# EAGLE design satshakit128 (EAGLE 7.5.0)
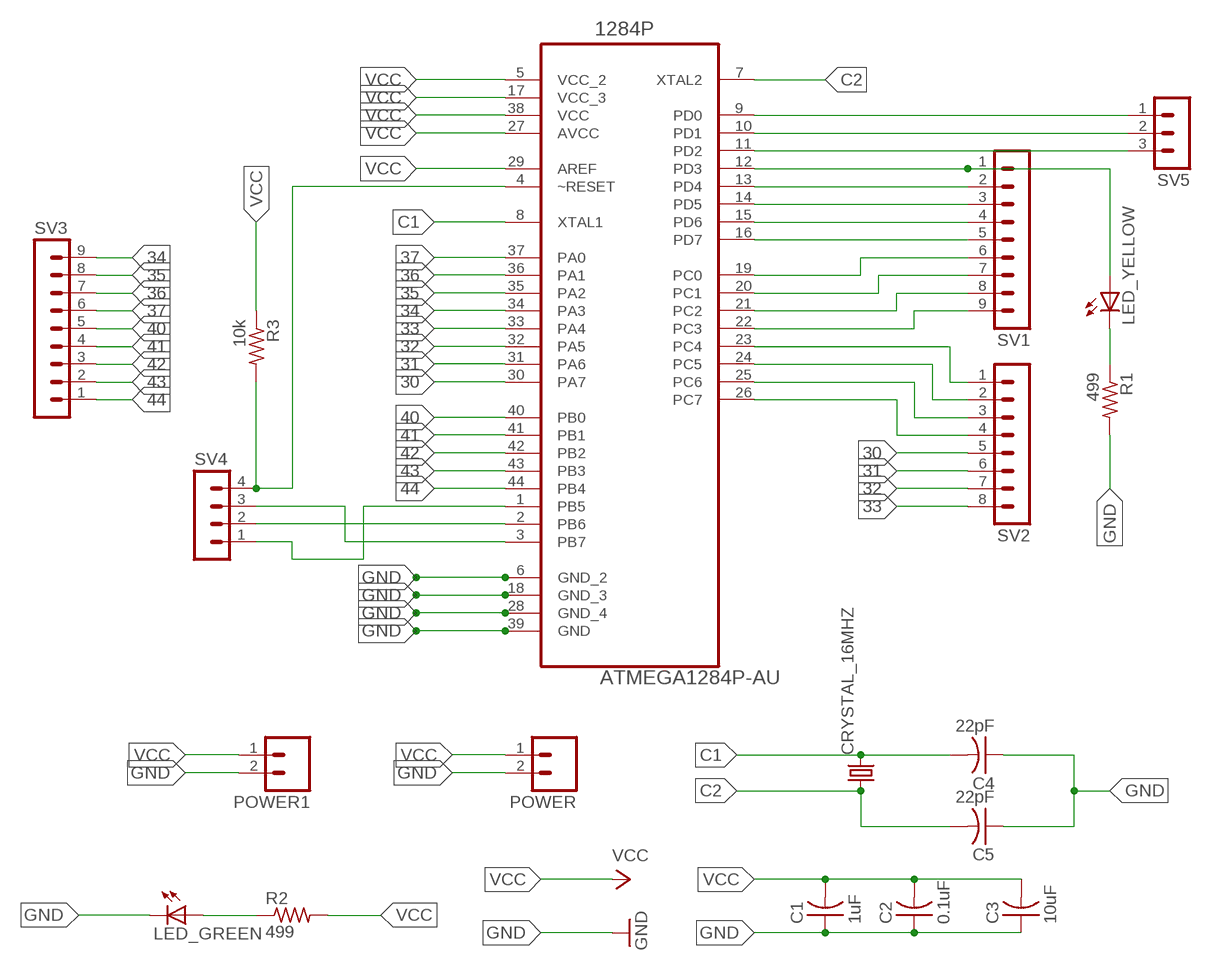
[diagram p0: schematic, sheet 1]

## Parts
1284P  ATMEGA1284P-AU  [QFP80P1200X1200X120-44N]
C1  1uF  CAP-US1206  [C1206]
C2  0.1uF  CAP-US1206  [C1206]
C3  10uF  CAP-US1206  [C1206]
C4  22pF  CAP-US1206  [C1206]
C5  22pF  CAP-US1206  [C1206]
CRYSTAL_16MHZ  CRYSTALHC49UP  [HC49UP]
LED_GREEN  LED1206  [1206]
LED_YELLOW  LED1206  [1206]
POWER  M02  [02P]
POWER1  M02  [02P]
R1  499  RES-US1206  [R1206]
R2  499  RES-US1206  [R1206]
R3  10k  RES-US1206  [R1206]
SV1  MA09-1  [MA09-1]
SV2  MA08-1  [MA08-1]
SV3  MA09-1  [MA09-1]
SV4  MA04-1  [MA04-1]
SV5  MA03-1  [MA03-1]

## Nets
30: 1284P.30(PA7) SV2.5
31: 1284P.31(PA6) SV2.6
32: 1284P.32(PA5) SV2.7
33: 1284P.33(PA4) SV2.8
34: 1284P.34(PA3) SV3.9
35: 1284P.35(PA2) SV3.8
36: 1284P.36(PA1) SV3.7
37: 1284P.37(PA0) SV3.6
40: 1284P.40(PB0) SV3.5
41: 1284P.41(PB1) SV3.4
42: 1284P.42(PB2) SV3.3
43: 1284P.43(PB3) SV3.2
44: 1284P.44(PB4) SV3.1
C1: 1284P.8(XTAL1) C4.2 CRYSTAL_16MHZ.2
C2: 1284P.7(XTAL2) C5.2 CRYSTAL_16MHZ.1
GND: 1284P.6(GND_2) C1.1 C2.1 C3.1 C4.1 C5.1 LED_GREEN.2(C) POWER1.2 POWER.2 R1.2
N$1: 1284P.18(GND_3)
N$2: 1284P.28(GND_4)
N$3: 1284P.39(GND)
N$4: 1284P.19(PC0) SV1.6
N$5: 1284P.20(PC1) SV1.7
N$6: 1284P.38(VCC)
N$7: 1284P.16(PD7) SV1.5
N$8: 1284P.14(PD5) SV1.3
N$9: 1284P.13(PD4) SV1.2
N$10: 1284P.12(PD3) LED_YELLOW.1(A) SV1.1
N$11: 1284P.11(PD2) SV5.3
N$12: 1284P.10(PD1) SV5.2
N$13: 1284P.9(PD0) SV5.1
N$14: 1284P.21(PC2) SV1.8
N$15: 1284P.22(PC3) SV1.9
N$16: 1284P.23(PC4) SV2.1
N$17: 1284P.24(PC5) SV2.2
N$18: 1284P.25(PC6) SV2.3
N$19: 1284P.26(PC7) SV2.4
N$20: 1284P.15(PD6) SV1.4
N$21: 1284P.3(PB7) SV4.3
N$22: 1284P.2(PB6) SV4.2
N$23: 1284P.1(PB5) SV4.1
N$24: 1284P.4(~RESET) R3.2 SV4.4
N$25: LED_YELLOW.2(C) R1.1
N$26: LED_GREEN.1(A) R2.1
VCC: 1284P.5(VCC_2) 1284P.17(VCC_3) 1284P.27(AVCC) 1284P.29(AREF) C1.2 C2.2 C3.2 POWER1.1 POWER.1 R2.2 R3.1

## Library data of the parts
1284P = 1284:ATMEGA1284P-AU: Microcontroller with Programmable Flash; MPN: ATMEGA1284P-AU; OC_FARNELL: 1715480; OC_NEWARK: 15R0263; PACKAGE: TQFP-44; SUPPLIER: Atmel
C1-C5 = fab:CAP-US
CRYSTAL_16MHZ = crystal:CRYSTAL: CRYSTAL; OC_FARNELL: unknown; OC_NEWARK: unknown
LED_GREEN LED_YELLOW = FAB_Hello:LED
POWER POWER1 = con-amp-quick:M02: AMP QUICK CONNECTOR; OC_FARNELL: unknown; OC_NEWARK: unknown
R1-R3 = fab:RES-US: Resistor (US Symbol) Variants with postfix FAB are widened to allow the routing of internal traces
SV1 SV3 = con-lstb:MA09-1: PIN HEADER; OC_FARNELL: unknown; OC_NEWARK: unknown
SV2 = con-lstb:MA08-1: PIN HEADER; OC_FARNELL: unknown; OC_NEWARK: unknown
SV4 = con-lstb:MA04-1: PIN HEADER; OC_FARNELL: unknown; OC_NEWARK: unknown
SV5 = con-lstb:MA03-1: PIN HEADER; OC_FARNELL: unknown; OC_NEWARK: unknown

## Board
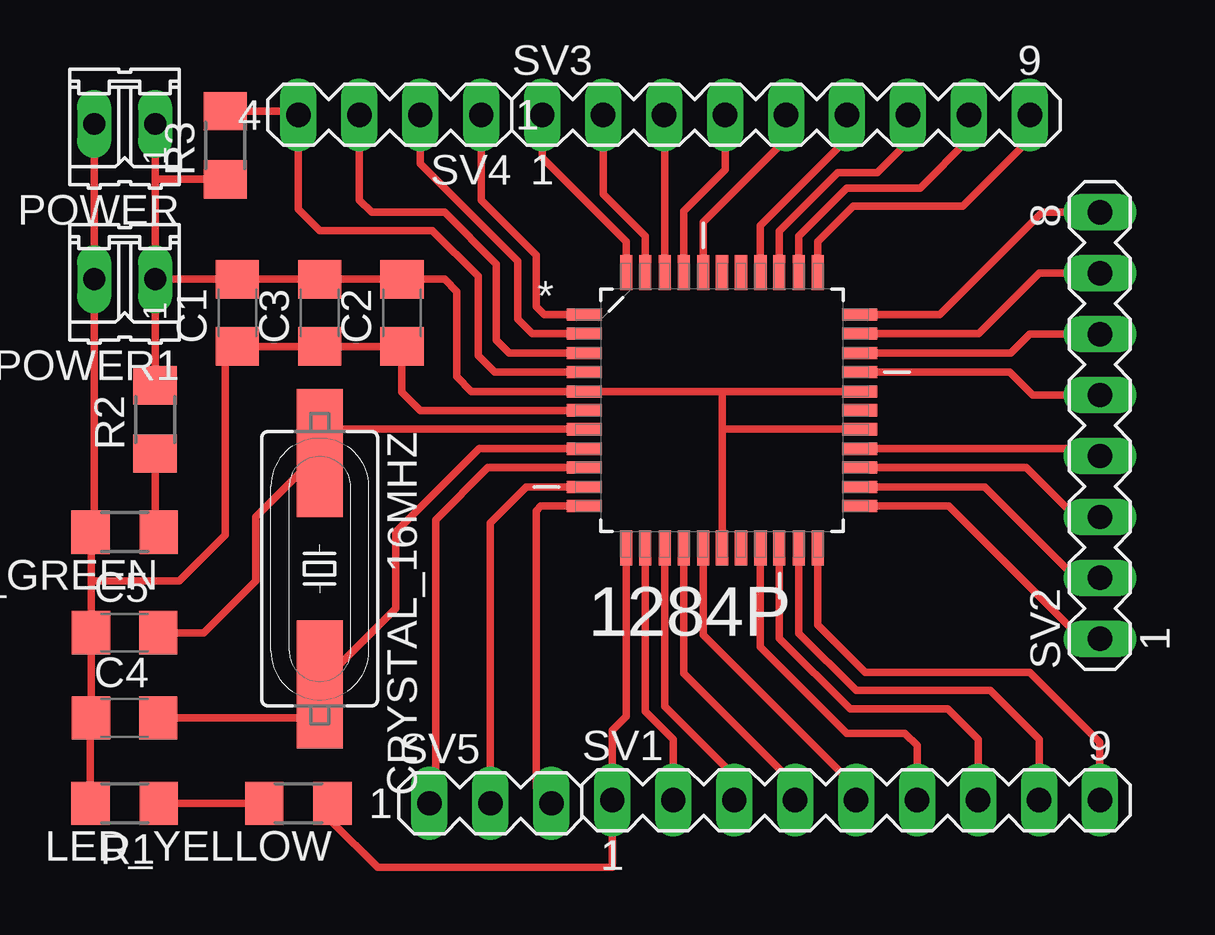
[diagram p1: board, top side]

No outline drawn. Coordinates in mm, seen from the top.
Copper layers (1*16): Top 0.035mm / dielectric 1.5mm / Bottom 0.035mm
Design rules "default": minimum track width 10mil, minimum drill 24mil, track to track 8mil, track to pad 8mil, pad to pad 8mil, via to via 8mil, smd to smd 8mil, copper to edge 40mil, drill to drill 8mil, minimum pad ring 10mil, minimum via ring 8mil, stop-mask expansion 4mil, vias tented up to drill 0mil, thermal gap 10mil

### Footprints (pad centres in the part's own frame; a part is rotated, then mirrored left to right if it is on the bottom)
QFP80P1200X1200X120-44N = smd 1.473 x 0.508: 1 -5.74,3.988; 2 -5.74,3.2; 3 -5.74,2.388; 4 -5.74,1.6; 5 -5.74,0.787; 6 -5.74,0; 7 -5.74,-0.787; 8 -5.74,-1.6; 9 -5.74,-2.388; 10 -5.74,-3.2; 11 -5.74,-3.988; 23 5.74,-3.988; 24 5.74,-3.2; 25 5.74,-2.388; 26 5.74,-1.6; 27 5.74,-0.787; 28 5.74,0; 29 5.74,0.787; 30 5.74,1.6; 31 5.74,2.388; 32 5.74,3.2; 33 5.74,3.988 | smd 0.508 x 1.473: 12 -3.988,-5.74; 13 -3.2,-5.74; 14 -2.388,-5.74; 15 -1.6,-5.74; 16 -0.787,-5.74; 17 0,-5.74; 18 0.787,-5.74; 19 1.6,-5.74; 20 2.388,-5.74; 21 3.2,-5.74; 22 3.988,-5.74; 34 3.988,5.74; 35 3.2,5.74; 36 2.388,5.74; 37 1.6,5.74; 38 0.787,5.74; 39 0,5.74; 40 -0.787,5.74; 41 -1.6,5.74; 42 -2.388,5.74; 43 -3.2,5.74; 44 -3.988,5.74
C1206 = smd 1.6 x 1.8: 1 -1.4,0; 2 1.4,0
HC49UP = smd 5.334 x 1.93: 1 -4.826,0; 2 4.826,0
1206 = smd 1.6 x 1.803: 1 -1.422,0; 2 1.422,0
02P = drill 0.914 long: 1 -1.27,0; 2 1.27,0
R1206 = smd 1.6 x 1.803: 1 -1.422,0; 2 1.422,0
MA09-1 = drill 1.016 long: 1 -10.16,0; 2 -7.62,0; 3 -5.08,0; 4 -2.54,0; 5 0,0; 6 2.54,0; 7 5.08,0; 8 7.62,0; 9 10.16,0
MA08-1 = drill 1.016 long: 1 -8.89,0; 2 -6.35,0; 3 -3.81,0; 4 -1.27,0; 5 1.27,0; 6 3.81,0; 7 6.35,0; 8 8.89,0
MA04-1 = drill 1.016 long: 1 -3.81,0; 2 -1.27,0; 3 1.27,0; 4 3.81,0
MA03-1 = drill 1.016 long: 1 -2.54,0; 2 0,0; 3 2.54,0

### Placement (x,y rotation side)
1284P  31.75,45.72 0 top
C1  11.56,49.78 90 top
C2  18.41,49.78 90 top
C3  14.99,49.78 90 top
C4  6.86,32.89 0 top
C5  6.86,36.45 0 top
CRYSTAL_16MHZ  14.99,39.12 270 top
LED_GREEN  6.86,40.64 180 top
LED_YELLOW  14.1,29.34 180 top
POWER  6.86,57.66 180 top
POWER1  6.86,51.18 180 top
R1  6.86,29.34 180 top
R2  8.13,45.34 90 top
R3  11.05,56.77 90 top
SV1  37.34,29.46 0 top
SV2  47.5,45.09 90 top
SV3  34.42,58.04 0 top
SV4  17.91,58.04 180 top
SV5  22.1,29.34 0 top

### Tracks (layer width: path | path; a pad name or v marks a point on that pad's centre or on a via)
30
  Top 0.305: 1284P.30 43.74,47.32 44.7,46.35 SV2.5
31
  Top 0.305: 1284P.31 43.79,48.11 44.58,48.9 SV2.6
32
  Top 0.305: 1284P.32 42.44,48.92 44.96,51.44 SV2.7
33
  Top 0.305: 1284P.33 40.82,49.71 45.09,53.98 SV2.8
34
  Top 0.305: 1284P.34 35.74,52.76 37.21,54.23 41.78,54.23 44.58,57.02 SV3.9
35
  Top 0.305: 1284P.35 34.95,52.98 36.96,54.99 40.01,54.99 42.04,57.02 SV3.8
36
  Top 0.305: 1284P.36 34.14,53.19 36.58,55.63 38.23,55.63 39.5,56.9 SV3.7
37
  Top 0.305: 1284P.37 33.35,53.42 36.96,57.02 SV3.6
40
  Top 0.305: 1284P.40 30.96,53.57 34.42,57.02 SV3.5
41
  Top 0.305: 1284P.41 30.15,54.03 31.88,55.75 SV3.4
42
  Top 0.305: 1284P.42 29.36,58.01 SV3.3
43
  Top 0.305: 1284P.43 28.55,52.98 26.8,54.74 SV3.2
44
  Top 0.305: 1284P.44 27.76,52.76 24.26,56.26 SV3.1
C1
  Top 0.305: C4.2 14.99,32.89 CRYSTAL_16MHZ.2 18.16,37.47 18.16,40.64 21.64,44.12 1284P.8
C2
  Top 0.305: C5.2 10.16,36.45 12.32,38.61 12.32,41.27 CRYSTAL_16MHZ.1 14.99,44.93 1284P.7
GND
  Top 0.305: 1284P.6 19.18,45.72 18.41,46.48 C2.1 C3.1 C1.1 11.05,48.38 11.05,40.51 9.14,38.61 5.46,38.61 | R1.2 5.44,32.87 C4.1 C5.1 5.46,38.61 | LED_GREEN.2 5.44,39.9 5.46,39.88 | 5.46,39.98 LED_GREEN.2 | LED_GREEN.2 5.59,40.16 POWER1.2 POWER.2 | 5.59,40.79 LED_GREEN.2 | 5.46,38.61 5.46,40.62 LED_GREEN.2
N$4
  Top 0.305: 1284P.19 33.35,35.87 36.96,32.26 39.37,32.26 39.88,31.75 SV1.6
N$5
  Top 0.305: 1284P.20 34.14,36.22 37.08,33.27 41.15,33.27 42.42,32 SV1.7
N$7
  Top 0.305: 1284P.16 30.96,36.35 37.34,29.97 SV1.5
N$8
  Top 0.305: 1284P.14 29.36,33.38 32.26,30.48 SV1.3
N$9
  Top 0.305: 1284P.13 28.55,33.17 29.72,32 SV1.2
N$10
  Top 0.305: 15.52,29.31 LED_YELLOW.1 15.49,29.31 15.49,28.57 17.4,26.67 27.18,26.67 SV1.1 27.18,32.38 27.76,32.97 1284P.12
N$11
  Top 0.305: 1284P.11 24.21,41.73 24,41.53 24,29.97 SV5.3
N$12
  Top 0.305: 1284P.10 23.6,42.52 22.1,41.02 SV5.2
N$13
  Top 0.305: 1284P.9 22,43.33 19.81,41.15 19.81,29.59 SV5.1
N$14
  Top 0.305: 1284P.21 34.95,36.42 37.34,34.04 42.93,34.04 44.96,32 SV1.8
N$15
  Top 0.305: 1284P.22 35.74,36.78 37.72,34.8 44.58,34.8 47.5,31.88 47.5,30.86 47.5,30.35 SV1.9
N$16
  Top 0.305: 1284P.23 41.2,41.73 46.74,36.2 SV2.1
N$17
  Top 0.305: 1284P.24 42.7,42.52 46.48,38.73 SV2.2
N$18
  Top 0.305: 1284P.25 44.42,43.33 46.48,41.27 SV2.3
N$19
  Top 0.305: 1284P.26 47.19,44.12 SV2.4
N$20
  Top 0.305: 1284P.15 30.15,34.75 34.8,30.1 SV1.4
N$21
  Top 0.305: 1284P.3 22.89,48.11 22.35,48.64 22.35,51.82 20.19,53.98 17.14,53.98 16.64,54.48 SV4.3
N$22
  Top 0.305: 1284P.2 23.85,48.92 23.24,49.53 23.24,51.94 19.18,56.01 SV4.2
N$23
  Top 0.305: 1284P.1 24.33,49.71 24,50.04 24,52.2 21.72,54.48 SV4.1
N$24
  Top 0.305: 1284P.4 22.28,47.32 21.59,48.01 21.59,51.31 19.68,53.21 14.99,53.21 14.1,54.1 SV4.4 13.95,58.19 R3.2
N$25
  Top 0.305: LED_YELLOW.2 R1.1
N$26
  Top 0.305: LED_GREEN.1 8.13,40.79 R2.1
VCC
  Top 0.305: 31.75,44.93 1284P.17 | 1284P.29 31.75,46.51 | 31.75,46.51 1284P.5 21.31,46.51 20.7,47.12 20.7,50.67 20.19,51.18 C2.2 C3.2 C1.2 POWER1.1 | 1284P.27 31.75,44.93 | 31.75,44.93 31.75,46.51 | R2.2 POWER1.1 | POWER1.1 8.13,55.37 | 8.13,55.37 POWER.1 | R3.1 8.15,55.35 8.13,55.37